# Altium project power-v2.2.PrjPCB
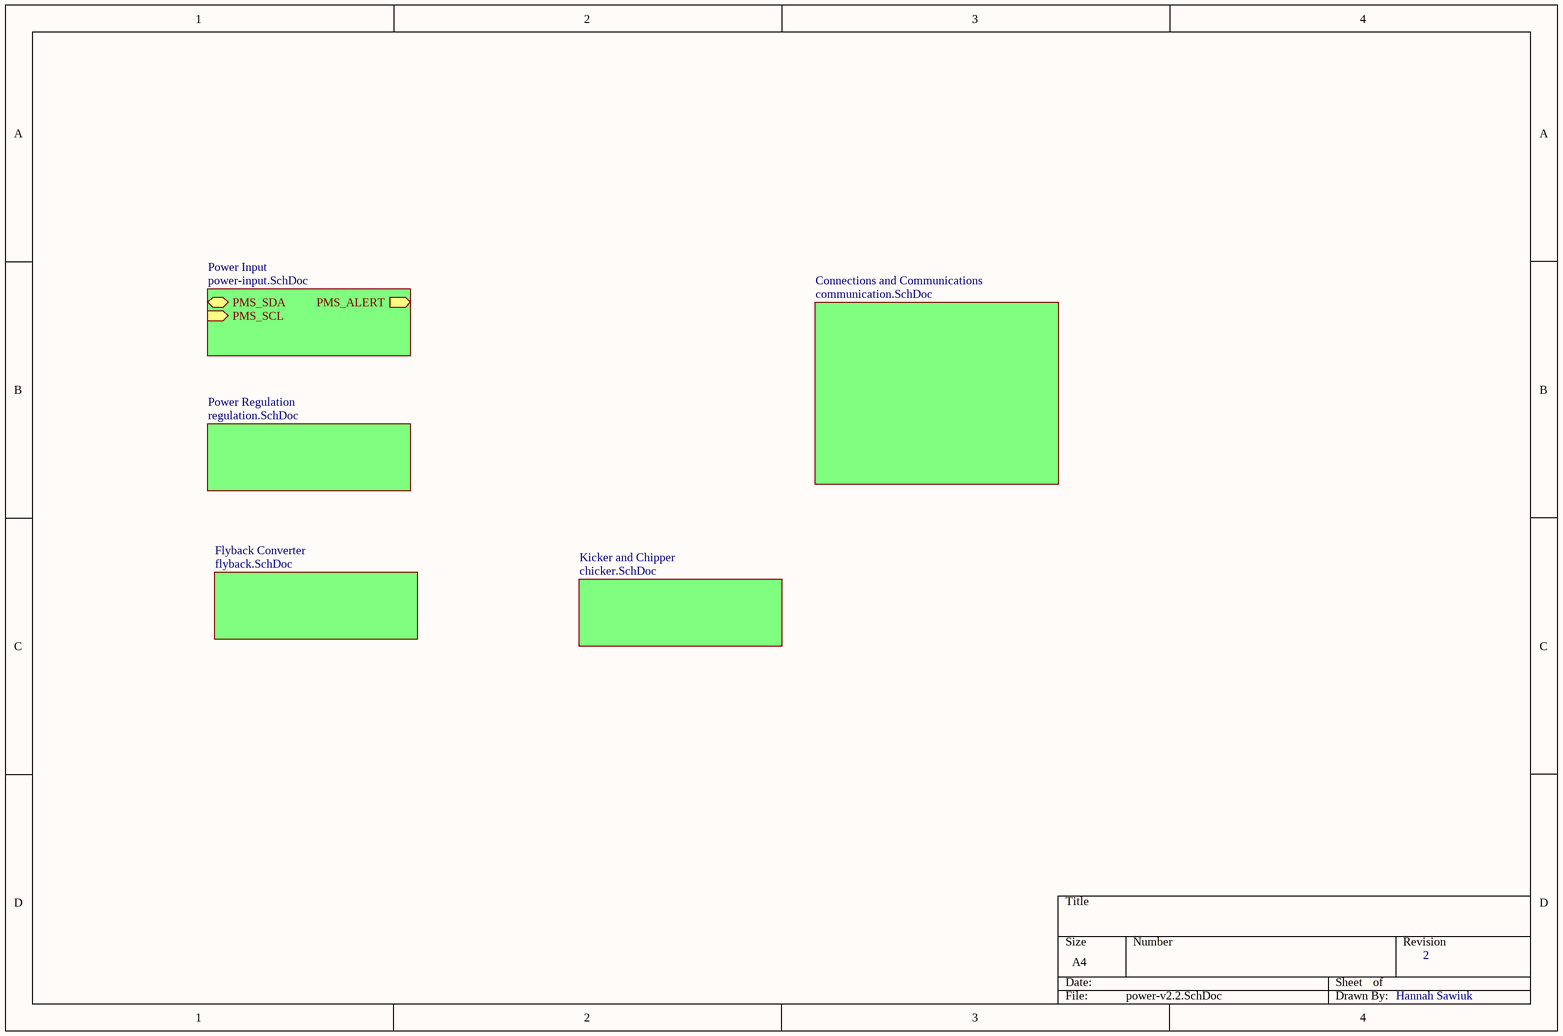
[diagram p0: power-v2.2.SchDoc]
6 sheets, 88 parts. Net scope: hierarchical (ports join the sheet entries above them; power ports are global).
Board file: power-v2.2.PcbDoc
Sheets:
  power-v2.2.SchDoc
    Flyback Converter = flyback.SchDoc
    Power Regulation = regulation.SchDoc
    Kicker and Chipper = chicker.SchDoc
    Power Input = power-input.SchDoc
    Connections and Communications = communication.SchDoc

## Sheet power-v2.2.SchDoc
size A4

### Sub-sheets
Connections and Communications = communication.SchDoc: no entries
Flyback Converter = flyback.SchDoc: no entries
Kicker and Chipper = chicker.SchDoc: no entries
Power Input = power-input.SchDoc: PMS_SDA (bidir), PMS_SCL (in), PMS_ALERT (out)
Power Regulation = regulation.SchDoc: no entries

### Notes on the sheet
- 2
- Hannah Sawiuk

## Sheet flyback.SchDoc
size A4
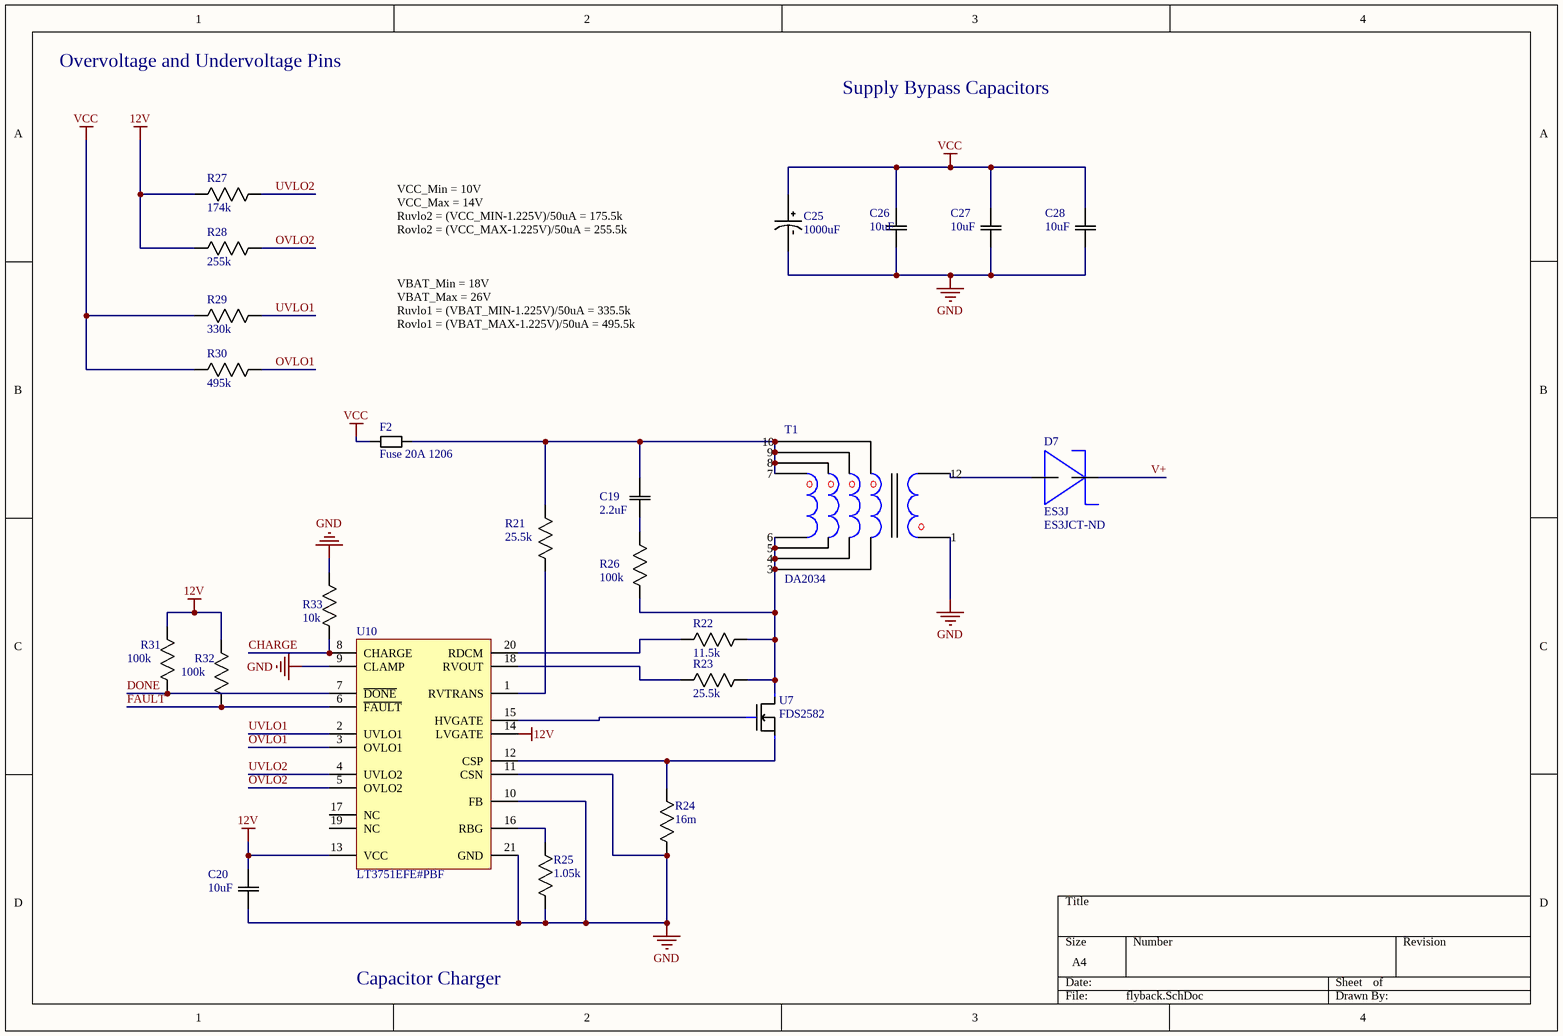
[diagram p1: flyback.SchDoc]

### Parts
C19  2.2uF  [0805]
C20  10uF  [0805]
C25  1000uF  [CAP POL 1000uF THRU]
C26  10uF  [0805]
C27  10uF  [0805]
C28  10uF  [0805]
D7  ES3J  Supplier Part Number 1: ES3JCT-ND  [D0214-AB]
F2  Fuse 20A 1206  [1206]
R21  25.5k  [0805]
R22  11.5k  [0805]
R23  25.5k  [0805]
R24  16m  [0805]
R25  1.05k  [0805]
R26  100k  [0805]
R27  174k  [0805]
R28  255k  [0805]
R29  330k  [0805]
R30  495k  [0805]
R31  100k  [0805]
R32  100k  [0805]
R33  10k  [0805]
T1  DA2034  [DA2034]
U7  FDS2582  [8-SOIC MOSFET]
U10  LT3751EFE#PBF  [LT-FE-20-EPV-CB_L]

### Nets
12V: C20.1(C1) R27.2(R2) R28.2(R2) R31.2(R2) R32.2(R2) U10.13(VCC) U10.14(LVGATE)
GND: C20.2(C2) C25.NEG C26.2(C2) C27.2(C2) C28.2(C2) R24.2(R2) R25.2(R2) R33.1(R1) T1.1 U10.9(CLAMP) U10.10(FB) U10.11(CSN) U10.21(GND)
VCC: C25.POS C26.1(C1) C27.1(C1) C28.1(C1) F2.1 R29.2(R2) R30.2(R2)
CHARGE: R33.2(R2) U10.8(CHARGE)
DONE: R31.1(R1) U10.7(~{DONE})
FAULT: R32.1(R1) U10.6(~{FAULT})
OVLO1: R30.1(R1) U10.3(OVLO1)
OVLO2: R28.1(R1) U10.5(OVLO2)
UVLO1: R29.1(R1) U10.2(UVLO1)
UVLO2: R27.1(R1) U10.4(UVLO2)
V+: D7.OUT
NetC19_1: C19.1(C1) R26.1(R1)
NetC19_2: C19.2(C2) F2.2 R21.1(R1) T1.7 T1.8 T1.9 T1.10
NetD7_IN: D7.IN T1.12
NetR21_2: R21.2(R2) U10.1(RVTRANS)
NetR22_1: R22.1(R1) R23.1(R1) R26.2(R2) T1.3 T1.4 T1.5 T1.6 U7.D
NetR22_2: R22.2(R2) U10.20(RDCM)
NetR23_2: R23.2(R2) U10.18(RVOUT)
NetR24_1: R24.1(R1) U7.S U10.12(CSP)
NetR25_1: R25.1(R1) U10.16(RBG)
NetU7_G: U7.G U10.15(HVGATE)

Not connected (* = marked no-connect by the designer): U10 17(NC) 19(NC)

### Notes on the sheet
- Overvoltage and Undervoltage Pins
- Supply Bypass Capacitors
- VCC_Min = 10V
  VCC_Max = 14V
  Ruvlo2 = (VCC_MIN-1.225V)/50uA = 175.5k
  Rovlo2 = (VCC_MAX-1.225V)/50uA = 255.5k
- VBAT_Min = 18V
  VBAT_Max = 26V
  Ruvlo1 = (VBAT_MIN-1.225V)/50uA = 335.5k
  Rovlo1 = (VBAT_MAX-1.225V)/50uA = 495.5k
- Capacitor Charger

### Library data of the parts
C19 = CAP 2.2uF 0805: CAP CER 1UF 50V X7R 0805; MP: C0805C225K4RACTU; MF: KEMET; Tolerance: 10%; Rating: 16V; Package: 0805; Price: 0,461 CAD; Value: 2.2uF; Digikey: 399-3523-1-ND; Digikey Link: https://www.digikey.ca/products/en?keywords=399-3523-1-ND
C20 C26-C28 = CAP 10uF 0805: CAP CER 10UF 10V X5R 0805; MP: C0805C106K8PACTU; MF: KEMET; Tolerance: 10%; Package: 0805; Price: 0.168 CAD; Value: 10uF; Digikey: 399-4925-1-ND; Digikey Link: https://www.digikey.ca/product-detail/en/kemet/C0805C106K8PACTU/399-4925-1-ND/1090920; Rating: 10V
C25 = CAP POL 1000uF THRU: NICHICON   UVR1E102MPD1TD   ALUMINUM ELECTROLYTIC CAPACITOR, 1000UF, 25V, 20%, RADIAL, FULL REEL; Dielectric Material: Aluminium; Life (Hours): 2000Hour; Capacitance: 1mF; Leakage Current: 750uA; Dissipation Factor: 0.16%; Ripple Current: 960mA; Lead Diameter: 0.6mm; Supplier 1: Digi-Key; Manufacturer: Nichicon; Manufacturer Part Number: UVR1E102MPD1TD; RoHS: Yes; Category: Aluminum Electrolytic Capacitors; Stock 1: 43448; Pricing 1: 1=0.58000, 10=0.40800, 100=0.26890 (USD); Mount: Through Hole,PCB; Case/Package: Radial; Number of Pins: 2; Min Operating Temperature: -40°C; Max Operating Temperature: 85°C; Packaging: Tape and Reel; Tolerance: 20%; Voltage Rating (DC): 25V; Voltage Rating: 25V; Termination: Radial; Voltage: 25V; Package Quantity: 500; Diameter: 10mm; Length: 20mm; Height: 20mm; Height - Seated (Max): 0.866inch; Lead Pitch: 5mm; Radiation Hardening: No; REACH SVHC: No SVHC; Lead Free: Lead Free; ComponentLink1URL: https://datasheet.ciiva.com/7851/e-vr-7851718.pdf?src-supplier=Element14; ComponentLink1Description: https://datasheet.ciiva.com/7851/e-vr-7851718.pdf?src-supplier=Element14; ComponentLink2URL: https://datasheet.ciiva.com/6300/e-vr-6300009.pdf?src-supplier=Digi-Key; ComponentLink2Description: https://datasheet.ciiva.com/6300/e-vr-6300009.pdf?src-supplier=Digi-Key; ComponentLink3URL: https://datasheet.ciiva.com/6300/e-vr-6300010.pdf?src-supplier=Digi-Key; ComponentLink3Description: https://datasheet.ciiva.com/6300/e-vr-6300010.pdf?src-supplier=Digi-Key; ComponentLink4URL: https://datasheet.ciiva.com/11684/e-vr-11684106.pdf?src-supplier=Avnet; ComponentLink4Description: https://datasheet.ciiva.com/11684/e-vr-11684106.pdf?src-supplier=Avnet; ComponentLink5URL: https://datasheet.ciiva.com/16502/e-vr-16502813.pdf?src-supplier=Future+Electronics; ComponentLink5Description: https://datasheet.ciiva.com/16502/e-vr-16502813.pdf?src-supplier=Future+Electronics; ComponentLink6URL: https://datasheet.ciiva.com/46381/1909356-46381757.pdf?src-supplier=Element14; ComponentLink6Description: https://datasheet.ciiva.com/46381/1909356-46381757.pdf?src-supplier=Element14; Supplier Part Number 1: 493-5913-1-ND
D7 = ES3J: Diode Switching 600V 3A 2-Pin DO-214AB T/R; Manufacturer: ON Semiconductor / Fairchild; Element Configuration: Single; Power Dissipation: 1.66W; Reverse Recovery Time: 35ns; Peak Non-Repetitive Surge Current: 100A; Polarity: Standard; Capacitance: 45pF; Forward Voltage: 1.7V; Peak Reverse Current: 10uA; Supplier 1: Digi-Key; Manufacturer Part Number: ES3J; RoHS: Yes; Category: Zener Diodes; Stock 1: 20740; Pricing 1: 1=0.47000, 10=0.37800, 25=0.34600, 100=0.21740, 250=0.21492, 500=0.20126, 1000=0.13685 (USD); Mount: Surface Mount; Case/Package: SMC; Number of Pins: 2; Contact Plating: Tin,Matte; Min Operating Temperature: -50°C; Max Operating Temperature: 150°C; Reverse Voltage: 600V; Max Reverse Voltage (DC): 600V; Average Rectified Current: 3A; Max Repetitive Reverse Voltage (Vrrm): 600V; Max Forward Surge Current (Ifsm): 100A; Current: 3A; Voltage: 600V; Voltage Rating (DC): 600V; Current Rating: 3A; Output Current: 3A; Max Surge Current: 100A; Packaging: Tape and Reel; Package Quantity: 3000; Recovery Time: 35ns; Forward Current: 3A; Length: 7.11mm; Height: 2.616mm; Width: 6.223mm; Radiation Hardening: No; REACH SVHC: No SVHC; Lead Free: Lead Free; ComponentLink1URL: https://datasheet.ciiva.com/4452/es3j-187547-4452440.pdf?src-supplier=Mouser; ComponentLink1Description: https://datasheet.ciiva.com/4452/es3j-187547-4452440.pdf?src-supplier=Mouser; ComponentLink2URL: https://datasheet.ciiva.com/30479/0900766b810e1d0b-30479500.pdf?src-supplier=RSComponents; ComponentLink2Description: https://datasheet.ciiva.com/30479/0900766b810e1d0b-30479500.pdf?src-supplier=RSComponents; ComponentLink3URL: https://datasheet.ciiva.com/22651/1856389-22651960.pdf?src-supplier=Element14; ComponentLink3Description: https://datasheet.ciiva.com/22651/1856389-22651960.pdf?src-supplier=Element14; ComponentLink4URL: https://datasheet.ciiva.com/26230/es3j-26230952.pdf?src-supplier=Avnet+Europe; ComponentLink4Description: https://datasheet.ciiva.com/26230/es3j-26230952.pdf?src-supplier=Avnet+Europe; ComponentLink5URL: https://datasheet.ciiva.com/911/es3a-911003.pdf?src-supplier=Digi-Key; ComponentLink5Description: https://datasheet.ciiva.com/911/es3a-911003.pdf?src-supplier=Digi-Key; ComponentLink6URL: https://datasheet.ciiva.com/911/es3a-911004.pdf?src-supplier=Digi-Key; ComponentLink6Description: https://datasheet.ciiva.com/911/es3a-911004.pdf?src-supplier=Digi-Key; ComponentLink7URL: https://datasheet.ciiva.com/23683/1856389-23683564.pdf?src-supplier=Newark; ComponentLink7Description: https://datasheet.ciiva.com/23683/1856389-23683564.pdf?src-supplier=Newark; ComponentLink8URL: https://datasheet.ciiva.com/17194/es3j-17194703.pdf?src-supplier=Future+Electronics; ComponentLink8Description: https://datasheet.ciiva.com/17194/es3j-17194703.pdf?src-supplier=Future+Electronics; ComponentLink9URL: https://datasheet.ciiva.com/7965/1856389-7965165.pdf?src-supplier=Element14; ComponentLink9Description: https://datasheet.ciiva.com/7965/1856389-7965165.pdf?src-supplier=Element14; ComponentLink10URL: https://datasheet.ciiva.com/8300/es3j-8300861.pdf?src-supplier=Avnet; ComponentLink10Description: https://datasheet.ciiva.com/8300/es3j-8300861.pdf?src-supplier=Avnet
F2 = FUSE 20A 63V SLOW: FUSE 20A 32V AC 63V DC 1206; Response Time: Slow Blow; Current Rating (Amps): 20A; Voltage Rating - AC: 32V; Voltage Rating - DC: 63V; Operating Temperature: -55°C ~ 90°C
R21 R23 = RES 25.5k 0805: 0805 Resistor, 6A, 0.125W, 25ppm, 0.1%, 25K5; Manufacturer: Panasonic; Manufacturer Part Number: ERA-6AEB2552V; Temperature Coefficient: 25ppm/°C; Max Power Dissipation: 125mW; Resistance: 25.5kR; Voltage Rating: 100V; Supplier 1: Digi-Key; RoHS: Yes; Category: Chip SMD Resistors; Stock 1: 5872; Pricing 1: 1=0.36000, 10=0.30200, 100=0.11820, 1000=0.04948, 2500=0.04536 (USD); Mount: Surface Mount; Case/Package: 0805; Number of Pins: 2; Case Code (Imperial): 0805; Case Code (Metric): 2012; Contact Plating: Tin; Min Operating Temperature: -55°C; Max Operating Temperature: 155°C; Number of Terminations: 2; Features: Automotive AEC-Q200; Tolerance: 0.1%; Composition: Metal Film,Thin Film; Packaging: Tape and Reel; Military Standard: Not; Termination: Solder; Power Rating: 125mW; Package Quantity: 1; Voltage Rating (DC): 100V; Length: 2mm; Height: 0.5mm; Width: 1.25mm; Depth: 1.25mm; Radiation Hardening: No; Lead Free: Lead Free; ComponentLink1URL: https://datasheet.ciiva.com/11810/0900766b80eb1d8c-11810651.pdf?src-supplier=RSComponents; ComponentLink1Description: https://datasheet.ciiva.com/11810/0900766b80eb1d8c-11810651.pdf?src-supplier=RSComponents; ComponentLink2URL: https://datasheet.ciiva.com/26335/459526-da-01-en-widerstand-0805-era-26335831.pdf?src-supplier=Conrad; ComponentLink2Description: https://datasheet.ciiva.com/26335/459526-da-01-en-widerstand-0805-era-26335831.pdf?src-supplier=Conrad; ComponentLink3URL: https://datasheet.ciiva.com/7870/485442-7870651.pdf?src-supplier=Element14; ComponentLink3Description: https://datasheet.ciiva.com/7870/485442-7870651.pdf?src-supplier=Element14; ComponentLink4URL: https://datasheet.ciiva.com/5987/485442-5987308.pdf?src-supplier=Farnell; ComponentLink4Description: https://datasheet.ciiva.com/5987/485442-5987308.pdf?src-supplier=Farnell; ComponentLink5URL: https://datasheet.ciiva.com/7870/485442-7870652.pdf?src-supplier=Element14; ComponentLink5Description: https://datasheet.ciiva.com/7870/485442-7870652.pdf?src-supplier=Element14; ComponentLink6URL: https://datasheet.ciiva.com/30151/54aoa0000ce26-30151583.pdf?src-supplier=Onlinecomponents.com; ComponentLink6Description: https://datasheet.ciiva.com/30151/54aoa0000ce26-30151583.pdf?src-supplier=Onlinecomponents.com; ComponentLink7URL: https://datasheet.ciiva.com/9191/aoa0000ce26-9191422.pdf?src-supplier=Avnet; ComponentLink7Description: https://datasheet.ciiva.com/9191/aoa0000ce26-9191422.pdf?src-supplier=Avnet; Supplier Part Number 1: P25.5KDACT-ND
R22 = RES 11.5k 0805: Res Thin Film 0805 11.5K Ohm 0.1% 1/8W 25ppm/C Molded SMD SMD Punched Carrier T/R; Manufacturer: Panasonic; Manufacturer Part Number: ERA-6AEB1152V; Power Rating: 125mW; Resistance: 11.5kR; Voltage Rating: 100V; Temperature Coefficient: 25ppm/°C; Supplier 1: Digi-Key; RoHS: Yes; Category: Chip SMD Resistors; Stock 1: 10661; Pricing 1: 1=0.34000, 10=0.28800, 100=0.11260, 1000=0.04712, 2500=0.04320 (USD); Mount: Surface Mount; Case/Package: 0805; Number of Pins: 2; Case Code (Metric): 2012; Case Code (Imperial): 0805; Contact Plating: Tin; Min Operating Temperature: -55°C; Max Operating Temperature: 155°C; Tolerance: 0.1%; Packaging: Tape and Reel; Max Power Dissipation: 125mW; Composition: Thin Film,Metal Film; Number of Terminations: 2; Voltage Rating (DC): 100V; Termination: Solder; Military Standard: Not; Package Quantity: 1; Features: Automotive AEC-Q200; Length: 2mm; Height: 0.5mm; Width: 1.25mm; Depth: 1.25mm; Radiation Hardening: No; Lead Free: Lead Free; ComponentLink1URL: https://datasheet.ciiva.com/11810/0900766b80eb1d8c-11810868.pdf?src-supplier=RSComponents; ComponentLink1Description: https://datasheet.ciiva.com/11810/0900766b80eb1d8c-11810868.pdf?src-supplier=RSComponents; ComponentLink2URL: https://datasheet.ciiva.com/41450/001181306-da-01-en-widerstand-era-0805-11k5-0-1-5000st-41450464.pdf?src-supplier=Conrad; ComponentLink2Description: https://datasheet.ciiva.com/41450/001181306-da-01-en-widerstand-era-0805-11k5-0-1-5000st-41450464.pdf?src-supplier=Conrad; ComponentLink3URL: https://datasheet.ciiva.com/5987/485442-5987301.pdf?src-supplier=Farnell; ComponentLink3Description: https://datasheet.ciiva.com/5987/485442-5987301.pdf?src-supplier=Farnell; ComponentLink4URL: https://datasheet.ciiva.com/7829/485442-7829142.pdf?src-supplier=Element14; ComponentLink4Description: https://datasheet.ciiva.com/7829/485442-7829142.pdf?src-supplier=Element14; ComponentLink5URL: https://datasheet.ciiva.com/17211/aoa0000ce26-17211855.pdf?src-supplier=Avnet+Europe; ComponentLink5Description: https://datasheet.ciiva.com/17211/aoa0000ce26-17211855.pdf?src-supplier=Avnet+Europe; ComponentLink6URL: https://datasheet.ciiva.com/7829/485442-7829143.pdf?src-supplier=Element14; ComponentLink6Description: https://datasheet.ciiva.com/7829/485442-7829143.pdf?src-supplier=Element14; ComponentLink7URL: https://datasheet.ciiva.com/9193/aoa0000ce26-9193735.pdf?src-supplier=Avnet; ComponentLink7Description: https://datasheet.ciiva.com/9193/aoa0000ce26-9193735.pdf?src-supplier=Avnet; ComponentLink8URL: https://datasheet.ciiva.com/24024/aoa0000ce26-197354-24024328.pdf?src-supplier=Mouser; ComponentLink8Description: https://datasheet.ciiva.com/24024/aoa0000ce26-197354-24024328.pdf?src-supplier=Mouser; Supplier Part Number 1: P11.5KDACT-ND
R24 = RES 16mOhm 0805: Res Thick Film 0805 0.016 Ohm 1% 0.5W(1/2W) ±200ppm/C Molded SMD Automotive Punched T/R; Manufacturer: Panasonic; Manufacturer Part Number: ERJ-6BWFR016V; Resistance: 16mR; Power Rating: 500mW; Temperature Coefficient: 200ppm/°C; Supplier 1: Digi-Key; RoHS: Yes; Category: Chip SMD Resistors; Stock 1: 4585; Pricing 1: 1=0.65000, 10=0.53800, 100=0.36140, 1000=0.21148, 2500=0.20917 (USD); Mount: Surface Mount; Case/Package: 0805; Number of Pins: 2; Contact Plating: Tin; Case Code (Metric): 2012; Case Code (Imperial): 0805; Min Operating Temperature: -55°C; Max Operating Temperature: 155°C; Tolerance: 1%; Packaging: Tape and Reel; Package Quantity: 1; Features: Automotive AEC-Q200; Max Power Dissipation: 500mW; Composition: Thick Film; Number of Terminations: 2; Termination: SMD/SMT; Military Standard: Not; Length: 2mm; Height: 0.028inch; Width: 0.049inch; Depth: 1.25mm; Radiation Hardening: No; Lead Free: Lead Free; ComponentLink1URL: https://datasheet.ciiva.com/11808/0900766b8126441d-11808690.pdf?src-supplier=RSComponents; ComponentLink1Description: https://datasheet.ciiva.com/11808/0900766b8126441d-11808690.pdf?src-supplier=RSComponents; ComponentLink2URL: https://datasheet.ciiva.com/2452/aoa0000ce3-2452594.pdf?src-supplier=Digi-Key; ComponentLink2Description: https://datasheet.ciiva.com/2452/aoa0000ce3-2452594.pdf?src-supplier=Digi-Key; ComponentLink3URL: https://datasheet.ciiva.com/2452/aoa0000ce3-2452592.pdf?src-supplier=Digi-Key; ComponentLink3Description: https://datasheet.ciiva.com/2452/aoa0000ce3-2452592.pdf?src-supplier=Digi-Key; ComponentLink4URL: https://datasheet.ciiva.com/2452/aoa0000ce3-2452593.pdf?src-supplier=Digi-Key; ComponentLink4Description: https://datasheet.ciiva.com/2452/aoa0000ce3-2452593.pdf?src-supplier=Digi-Key; ComponentLink5URL: https://datasheet.ciiva.com/9192/aoa0000ce3-9192761.pdf?src-supplier=Avnet; ComponentLink5Description: https://datasheet.ciiva.com/9192/aoa0000ce3-9192761.pdf?src-supplier=Avnet; ComponentLink6URL: https://datasheet.ciiva.com/17211/aoa0000ce3-17211370.pdf?src-supplier=Avnet+Europe; ComponentLink6Description: https://datasheet.ciiva.com/17211/aoa0000ce3-17211370.pdf?src-supplier=Avnet+Europe; Supplier Part Number 1: P.016AQCT-ND
R25 = RES 1.05k 0805: Res Thin Film 0805 10.5K Ohm 0.1% 0.125W(1/8W) ±25ppm/C Molded SMD Automotive Punched T/R; Manufacturer: Panasonic; Manufacturer Part Number: ERA-6AEB1052V; Resistance: 10.5kR; Power Rating: 125mW; Voltage Rating: 100V; Temperature Coefficient: 25ppm/°C; Supplier 1: Digi-Key; RoHS: Yes; Category: Chip SMD Resistors; Stock 1: 21208; Pricing 1: 1=0.34000, 10=0.28800, 100=0.11260, 1000=0.04712, 2500=0.04320 (USD); Mount: Surface Mount; Case/Package: 0805; Number of Pins: 2; Case Code (Metric): 2012; Case Code (Imperial): 0805; Contact Plating: Tin; Min Operating Temperature: -55°C; Max Operating Temperature: 155°C; Tolerance: 0.1%; Packaging: Tape and Reel; Composition: Thin Film,Metal Film; Package Quantity: 1; Max Power Dissipation: 125mW; Number of Terminations: 2; Termination: Solder; Voltage Rating (DC): 100V; Features: Automotive AEC-Q200; Military Standard: Not; Length: 2mm; Height: 0.5mm; Width: 1.25mm; Depth: 1.25mm; Radiation Hardening: No; Lead Free: Lead Free; REACH SVHC: No SVHC; ComponentLink1URL: https://datasheet.ciiva.com/11810/0900766b80eb1d8c-11810443.pdf?src-supplier=RSComponents; ComponentLink1Description: https://datasheet.ciiva.com/11810/0900766b80eb1d8c-11810443.pdf?src-supplier=RSComponents; ComponentLink2URL: https://datasheet.ciiva.com/41450/001181303-da-01-en-widerstand-era-0805-10k5-0-1-5000st-41450463.pdf?src-supplier=Conrad; ComponentLink2Description: https://datasheet.ciiva.com/41450/001181303-da-01-en-widerstand-era-0805-10k5-0-1-5000st-41450463.pdf?src-supplier=Conrad; ComponentLink3URL: https://datasheet.ciiva.com/5987/485442-5987261.pdf?src-supplier=Farnell; ComponentLink3Description: https://datasheet.ciiva.com/5987/485442-5987261.pdf?src-supplier=Farnell; ComponentLink4URL: https://datasheet.ciiva.com/17211/aoa0000ce26-17211965.pdf?src-supplier=Avnet+Europe; ComponentLink4Description: https://datasheet.ciiva.com/17211/aoa0000ce26-17211965.pdf?src-supplier=Avnet+Europe; ComponentLink5URL: https://datasheet.ciiva.com/9194/aoa0000ce26-9194028.pdf?src-supplier=Avnet; ComponentLink5Description: https://datasheet.ciiva.com/9194/aoa0000ce26-9194028.pdf?src-supplier=Avnet; ComponentLink6URL: https://datasheet.ciiva.com/5987/485442-5987263.pdf?src-supplier=Farnell; ComponentLink6Description: https://datasheet.ciiva.com/5987/485442-5987263.pdf?src-supplier=Farnell; Supplier Part Number 1: P10.5KDACT-ND
R26 R31 R32 = RES 100k 0805: RES SMD 100K OHM 1% 1/8W 0805; MP: RC0805FR-07100KL; MF: Yageo; Rating: 0.125W; Digikey: 311-100KCRCT-ND; Price: 0.058 CAD; Package: 0805; Value: 100k; Digikey Link: https://www.digikey.ca/products/en?keywords=311-100KCRCT-ND; Tolerance: 1%
R27 = RES 174k 0805: RES SMD 174K OHM 1% 1/8W 0805; Manufacturer: Yageo; Manufacturer Part Number: RC0805FR-07174KL; Max Power Dissipation: 125mW; Resistance: 174kR; Temperature Coefficient: 100ppm/°C; Voltage Rating: 150V; Supplier 1: Digi-Key; RoHS: Yes; Category: Chip SMD Resistors; Stock 1: 27863; Pricing 1: 1=0.10000, 10=0.04000, 100=0.01630, 1000=0.00731, 2500=0.00635 (USD); Case/Package: 0805; Case Code (Metric): 2012; Case Code (Imperial): 0805; Contact Plating: Tin,Matte; Min Operating Temperature: -55°C; Max Operating Temperature: 155°C; Package Quantity: 1; Power Rating: 125mW; Tolerance: 1%; Packaging: Tape and Reel; Features: Moisture Resistant; Composition: Thick Film; Number of Terminations: 2; Termination: SMD/SMT; Military Standard: Not; Voltage Rating (DC): 150V; Length: 2mm; Height: 0.024inch; Width: 0.049inch; Depth: 1.25mm; Radiation Hardening: No; Lead Free: Lead Free; ComponentLink1URL: https://datasheet.ciiva.com/2509/pyu-r-int-thick-7-2509472.pdf?src-supplier=Digi-Key; ComponentLink1Description: https://datasheet.ciiva.com/2509/pyu-r-int-thick-7-2509472.pdf?src-supplier=Digi-Key; ComponentLink2URL: https://datasheet.ciiva.com/2509/pyu-r-int-thick-7-2509471.pdf?src-supplier=Digi-Key; ComponentLink2Description: https://datasheet.ciiva.com/2509/pyu-r-int-thick-7-2509471.pdf?src-supplier=Digi-Key; ComponentLink3URL: https://datasheet.ciiva.com/2509/pyu-r-int-thick-7-2509473.pdf?src-supplier=Digi-Key; ComponentLink3Description: https://datasheet.ciiva.com/2509/pyu-r-int-thick-7-2509473.pdf?src-supplier=Digi-Key; Supplier Part Number 1: 311-174KCRCT-ND
R28 = RES 255k 0805: 0805 Resistor, 6A, 0.125W, 25ppm, 0.1%, 255K; Manufacturer: Panasonic; Manufacturer Part Number: ERA-6AEB2553V; Max Power Dissipation: 125mW; Resistance: 255kR; Temperature Coefficient: 25ppm/°C; Voltage Rating (DC): 100V; Voltage Rating: 200V; Supplier 1: Digi-Key; RoHS: Yes; Category: Chip SMD Resistors; Stock 1: 7869; Pricing 1: 1=0.36000, 10=0.30200, 100=0.11820, 1000=0.04948, 2500=0.04536 (USD); Mount: Surface Mount; Case/Package: 0805; Number of Pins: 2; Weight: 0.000194oz; Case Code (Imperial): 0805; Case Code (Metric): 2012; Contact Plating: Tin; Min Operating Temperature: -55°C; Max Operating Temperature: 155°C; Features: Automotive AEC-Q200; Tolerance: 0.1%; Number of Terminations: 2; Packaging: Tape and Reel; Composition: Metal Film,Thin Film; Power Rating: 125mW; Termination: SMD/SMT; Military Standard: Not; Package Quantity: 1; Length: 2mm; Height: 0.5mm; Width: 1.25mm; Depth: 1.25mm; Radiation Hardening: No; Lead Free: Lead Free; REACH SVHC: No SVHC; ComponentLink1URL: https://datasheet.ciiva.com/11810/0900766b80eb1d8c-11810615.pdf?src-supplier=RSComponents; ComponentLink1Description: https://datasheet.ciiva.com/11810/0900766b80eb1d8c-11810615.pdf?src-supplier=RSComponents; ComponentLink2URL: https://datasheet.ciiva.com/41450/001181380-da-01-en-widerstand-era-0805-255k-0-1-5000st-41450539.pdf?src-supplier=Conrad; ComponentLink2Description: https://datasheet.ciiva.com/41450/001181380-da-01-en-widerstand-era-0805-255k-0-1-5000st-41450539.pdf?src-supplier=Conrad; ComponentLink3URL: https://datasheet.ciiva.com/5981/485442-5981317.pdf?src-supplier=Farnell; ComponentLink3Description: https://datasheet.ciiva.com/5981/485442-5981317.pdf?src-supplier=Farnell; ComponentLink4URL: https://datasheet.ciiva.com/5981/485442-5981318.pdf?src-supplier=Farnell; ComponentLink4Description: https://datasheet.ciiva.com/5981/485442-5981318.pdf?src-supplier=Farnell; ComponentLink5URL: https://datasheet.ciiva.com/5981/485442-5981319.pdf?src-supplier=Farnell; ComponentLink5Description: https://datasheet.ciiva.com/5981/485442-5981319.pdf?src-supplier=Farnell; ComponentLink6URL: https://datasheet.ciiva.com/5981/485442-5981320.pdf?src-supplier=Farnell; ComponentLink6Description: https://datasheet.ciiva.com/5981/485442-5981320.pdf?src-supplier=Farnell; ComponentLink7URL: https://datasheet.ciiva.com/17206/aoa0000ce26-17206655.pdf?src-supplier=Avnet+Europe; ComponentLink7Description: https://datasheet.ciiva.com/17206/aoa0000ce26-17206655.pdf?src-supplier=Avnet+Europe; Supplier Part Number 1: P255KDACT-ND
R29 = RES 330k 0805: RES SMD 274K OHM 1% 1/8W 0805
R30 = RES 495k 0805: RES SMD 499K OHM 1% 1/8W 0805; Manufacturer: Yageo; Manufacturer Part Number: RC0805FR-07499KL; Temperature Coefficient: 100ppm/°C; Voltage Rating (DC): 150V; Resistance: 499kR; Power Rating: 125mW; Supplier 1: Digi-Key; RoHS: Yes; Category: Chip SMD Resistors; Stock 1: 2275; Pricing 1: 1=0.10000, 10=0.04000, 100=0.01630, 1000=0.00731, 2500=0.00635 (USD); Case/Package: 0805; Case Code (Metric): 2012; Case Code (Imperial): 0805; Contact Plating: Tin,Lead,Matte; Min Operating Temperature: -55°C; Max Operating Temperature: 155°C; Termination: SMD/SMT; Composition: Thick Film; Military Standard: Not; Tolerance: 1%; Voltage Rating: 150V; Packaging: Tape and Reel; Length: 2mm; Depth: 1.25mm; Radiation Hardening: No; Lead Free: Lead Free; ComponentLink1URL: https://datasheet.ciiva.com/15189/getdatasheetpartid-326570-15189975.pdf?src-supplier=Verical; ComponentLink1Description: https://datasheet.ciiva.com/15189/getdatasheetpartid-326570-15189975.pdf?src-supplier=Verical; Supplier Part Number 1: 311-499KCRCT-ND
R33 = RES 10k 1/8W: RES SMD 10K OHM 1% 1/8W 0805; Power (Watts): 0.125W; Package: 0805; Value: 10k; Tolerance: 1%
T1 = DA2034: Audio Transformers / Signal Transformers DA2032 Cap Chrgr For Linear LT3750/51
U7 = FDS2582: N-Channel 150V 4.1A (Ta) 2.5W (Ta) Surface Mount 8-SOIC; MF: ON Semiconductor; MP: FDS2582; Digikey: FDS2582CT-ND; Price: 0.98 CAD; Rating: 150V; Digikey Link: https://www.digikey.com/product-detail/en/on-semiconductor/FDS2582/FDS2582CT-ND/3025307; Package: 8-SOIC
U10 = LT3751EFE#PBF: Controller to 20-Pin TSSOP EP; Manufacturer: Analog Devices / Linear Technology; Output Voltage: 500V; Output Current: 150mA; Max Input Voltage: 24V; Min Supply Voltage: 4.75V; Number of Outputs: 1; Operating Supply Current: 5.5mA; Supplier 1: Digi-Key; Manufacturer Part Number: LT3751EFE#PBF; RoHS: Yes; Category: Voltage Regulators - Switching; Stock 1: 1231; Pricing 1: 1=9.26000, 25=6.14640, 100=5.08200, 250=4.82792, 500=4.71900 (USD); Case/Package: TSSOP; Number of Pins: 20; Min Operating Temperature: -40°C; Max Operating Temperature: 125°C; Package Quantity: 74; Packaging: Rail/Tube; Termination: SMD/SMT; Max Supply Voltage: 24V; Radiation Hardening: No; REACH SVHC: No SVHC; ComponentLink1URL: https://datasheet.ciiva.com/15104/getdatasheetpartid-472813-15104438.pdf?src-supplier=Verical; ComponentLink1Description: https://datasheet.ciiva.com/15104/getdatasheetpartid-472813-15104438.pdf?src-supplier=Verical; ComponentLink2URL: https://datasheet.ciiva.com/31429/1692507-31429494.pdf?src-supplier=Farnell; ComponentLink2Description: https://datasheet.ciiva.com/31429/1692507-31429494.pdf?src-supplier=Farnell; ComponentLink3URL: https://datasheet.ciiva.com/1964/27024-1964843.pdf?src-supplier=Digi-Key; ComponentLink3Description: https://datasheet.ciiva.com/1964/27024-1964843.pdf?src-supplier=Digi-Key

## Sheet regulation.SchDoc
size A4
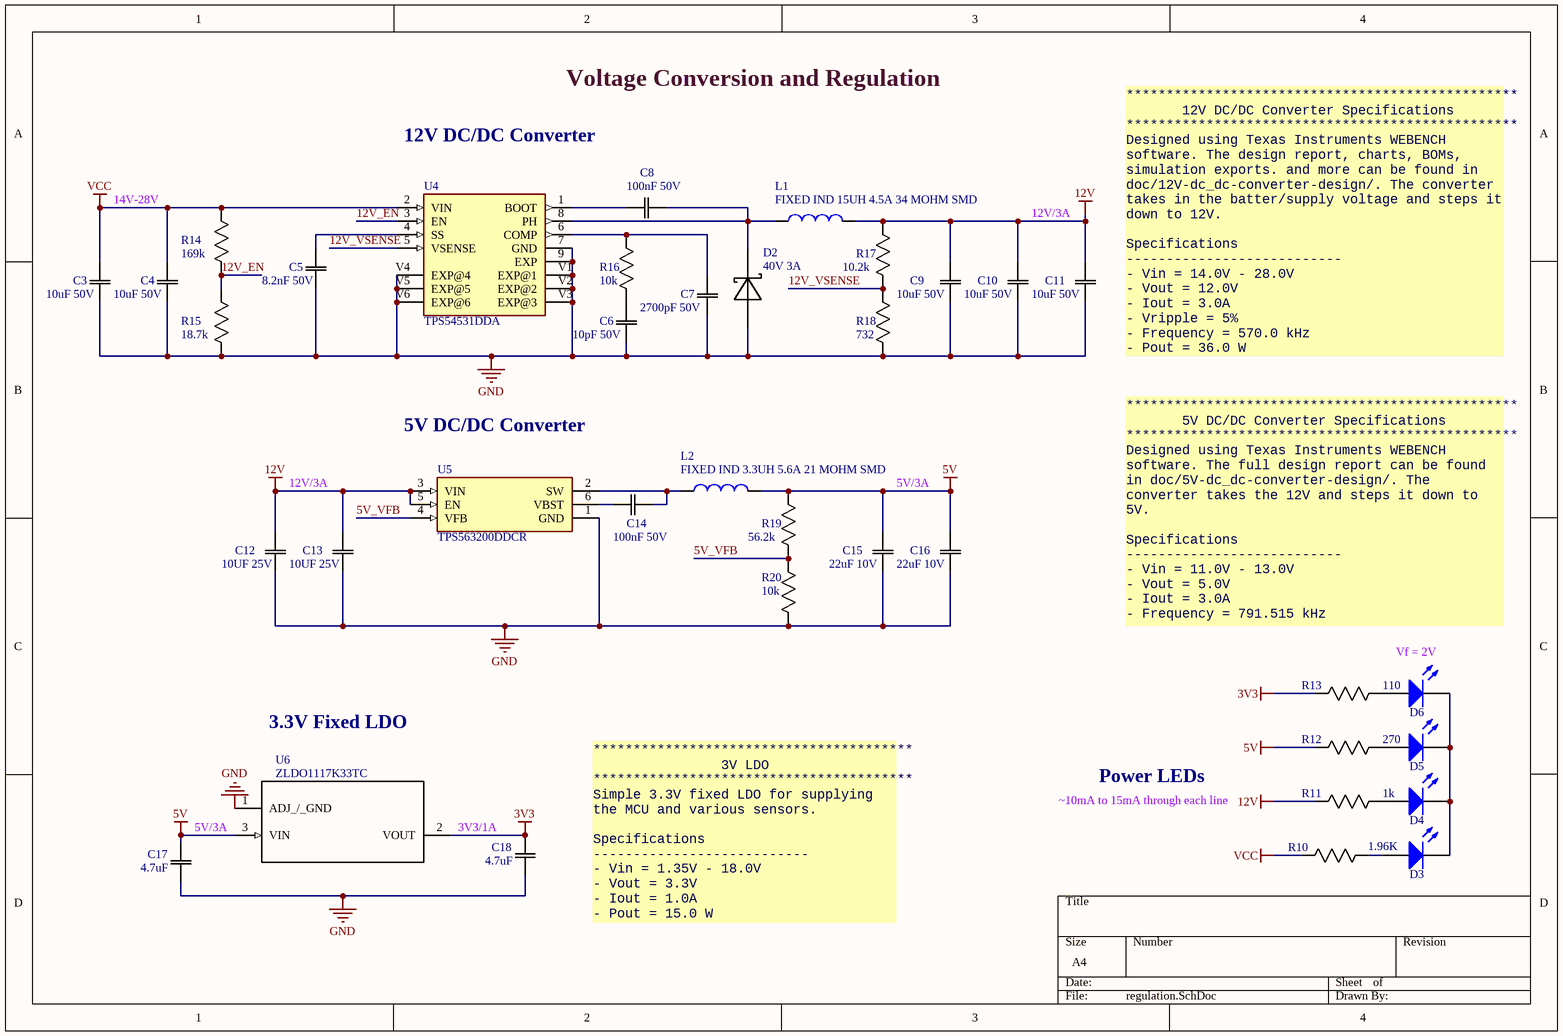
[diagram p2: regulation.SchDoc]

### Parts
C3  10uF 50V  [1210]
C4  10uF 50V  [1210]
C5  8.2nF 50V  [0805]
C6  10pF 50V  [0603]
C7  2700pF 50V  [0805]
C8  100nF 50V  [0805]
C9  10uF 50V  [1210]
C10  10uF 50V  [1210]
C11  10uF 50V  [1210]
C12  10UF 25V  [1206]
C13  10UF 25V  [1206]
C14  100nF 50V  [0805]
C15  22uF 10V  [0805]
C16  22uF 10V  [0805]
C17  4.7uF  [0805]
C18  4.7uF  [0805]
D2  40V 3A  [DO-214AC]
D3  LED2  [3.2X1.6X1.1]  (value not drawn)
D4  LED2  [3.2X1.6X1.1]  (value not drawn)
D5  LED2  [3.2X1.6X1.1]  (value not drawn)
D6  LED2  [3.2X1.6X1.1]  (value not drawn)
L1  FIXED IND 15UH 4.5A 34 MOHM SMD
L2  FIXED IND 3.3UH 5.6A 21 MOHM SMD
R10  1.96K  [0805]
R11  1k  [0805]
R12  270  [0805]
R13  110  [0805]
R14  169k  [0805]
R15  18.7k  [1206]
R16  10k  [0805]
R17  10.2k  [0805]
R18  732  [0805]
R19  56.2k  [0603]
R20  10k  [0805]
U4  TPS54531DDA  [8-PowerSOIC]
U5  TPS563200DDCR  [TSOT-23-6]
U6  ZLDO1117K33TC  [TO-252-3]

### Nets
3V3: C18.2(C2) R13.1(R1) U6.2(VOUT)
5V: C15.2(C2) C16.2(C2) C17.2(C2) L2.2 R12.1(R1) R19.1(R1) U6.3(VIN)
12V: C9.2(C2) C10.2(C2) C11.2(C2) C12.2(C2) C13.2(C2) L1.2 R11.1(R1) R17.2(R2) U5.3(VIN) U5.5(EN)
GND: C3.1(C1) C4.1(C1) C5.1(C1) C6.1(C1) C7.1(C1) C9.1(C1) C10.1(C1) C11.1(C1) C12.1(C1) C13.1(C1) C15.1(C1) C16.1(C1) C17.1(C1) C18.1(C1) D2.A R15.2(R2) R18.1(R1) R20.1(R1) U4.7(GND) U4.9(EXP) U4.V1(EXP@1) U4.V2(EXP@2) U4.V3(EXP@3) U4.V4(EXP@4) U4.V5(EXP@5) U4.V6(EXP@6) U5.1(GND) U6.1(ADJ_/_GND)
VCC: C3.2(C2) C4.2(C2) R10.1(R1) R14.1(R1) U4.2(VIN)
5V_VFB: R19.2(R2) R20.2(R2) U5.4(VFB)
12V_EN: R14.2(R2) R15.1(R1) U4.3(EN)
12V_VSENSE: R17.1(R1) R18.2(R2) U4.5(VSENSE)
NetC5_2: C5.2(C2) U4.4(SS)
NetC6_2: C6.2(C2) R16.2(R2)
NetC7_2: C7.2(C2) R16.1(R1) U4.6(COMP)
NetC8_1: C8.1(C1) U4.1(BOOT)
NetC8_2: C8.2(C2) D2.C(K) L1.1 U4.8(PH)
NetC14_1: C14.1(C1) U5.6(VBST)
NetC14_2: C14.2(C2) L2.1 U5.2(SW)
NetD3_1: D3.1(A) R10.2(R2)
NetD3_2: D3.2(K) D4.2(K) D5.2(K) D6.2(K)
NetD4_1: D4.1(A) R11.2(R2)
NetD5_1: D5.1(A) R12.2(R2)
NetD6_1: D6.1(A) R13.2(R2)

### Notes on the sheet
- Voltage Conversion and Regulation
- 12V DC/DC Converter
- 14V-28V
- 12V/3A
- (near C11) *************************************************
  12V DC/DC Converter Specifications
  *************************************************
  Designed using Texas Instruments WEBENCH software. The design report, charts, BOMs, simulation exports. and more can be found in doc/12V-dc_dc-converter-design/. The converter takes in the batter/supply voltage and steps it down to 12V.
  Specifications
  ---------------------------
  - Vin = 14.0V - 28.0V
  - Vout = 12.0V
  - Iout = 3.0A
  - Vripple = 5%
  - Frequency = 570.0 kHz
  - Pout = 36.0 W
- 5V DC/DC Converter
- 5V/3A
- *************************************************
  5V DC/DC Converter Specifications
  *************************************************
  Designed using Texas Instruments WEBENCH software. The full design report can be found in doc/5V-dc_dc-converter-design/. The converter takes the 12V and steps it down to 5V.
  Specifications
  ---------------------------
  - Vin = 11.0V - 13.0V
  - Vout = 5.0V
  - Iout = 3.0A
  - Frequency = 791.515 kHz
  - Pout = 15.0 W
- Vf = 2V
- 3.3V Fixed LDO
- Power LEDs
- 3V3/1A
- ~10mA to 15mA through each line
- ****************************************
  3V LDO
  ****************************************
  Simple 3.3V fixed LDO for supplying the MCU and various sensors.
  Specifications
  ---------------------------
  - Vin = 1.35V - 18.0V
  - Vout = 3.3V
  - Iout = 1.0A
  - Pout = 15.0 W

### Library data of the parts
C3 C4 C9-C11 = CAP 10uF 50V: CAP CER 10UF 50V X7R; Tolerance: 10%; Package: 1210; Value: 10uF; Rating: 50V; ComponentLink1Description: digikey; ComponentLink1URL: https://www.digikey.ca/en/products/detail/kemet/C1210C106M5RACTU/4918883
C5 = CAP 8.2nF 50V: CAP CER 8200PF 50V X7R 0805; Tolerance: 10%; Package: 0805; Value: 8.2nF; Rating: 50V; Temperature Coefficient: X7R; Operating Temperature: -55°C ~ 125°C
C6 = CAP 10pF 50V: CAP CER 10PF 50V X7R 0603; Tolerance: 10%; Package: 0603; Value: 10pF; Rating: 50V; ComponentLink1Description: digikey; ComponentLink1URL: https://www.digikey.ca/en/products/detail/kemet/C0603C100K5RAC7867/8572397
C7 = CAP 2700pF 50V: CAP CER 2700PF 50V X7R 0805; Tolerance: 10%; Package: 0805; Value: 2700pF; Rating: 50V; Temperature Coefficient: X7R; Operating Temperature: -55°C ~ 125°C
C8 C14 = CAP 100nF 50V: CAP CER 0.1UF 50V X7R 0805; Tolerance: 10%; Package: 0805; Value: 100nF; Rating: 50V
C12 C13 = CAP 10uF 25V: CAP CER 10UF 25V X5R 1206; Tolerance: 10%; Package: 1206; Value: 10uF; Rating: 25V; Temperature Coefficient: X5R; Operating Temperature: -55°C ~ 85°C
C15 C16 = CAP 22uF 10V: CAP CER 2.2UF 10V X5R 0805; Tolerance: 20%; Package: 0805; Value: 22uF; Rating: 10V; Temperature Coefficient: X5R; Operating Temperature: -55°C ~ 85°C
C17 C18 = CAP 4.7uF 0805: CAP CER 4.7UF 25V X5R 0805; MP: CL21B475KOFNNNE; MF: Samsung Electro-Mechanics; Tolerance: 10%; Rating: 16V; Temperature Coefficient: X7R; Package: 0805; Price: 0,49 CAD; Value: 4.7uF; Digikey: 1276-2873-1-ND; Digikey Link: https://www.digikey.ca/product-detail/en/samsung-electro-mechanics/CL21B475KOFNNNE/1276-2873-1-ND/3890959
D2 = DIODE SCHOTTKY 40V 3A: Diode Schottky 40V 3A Surface Mount SMA; Voltage - Forward (Vf) (Max) @ If: 450mV @ 3A; ComponentLink1Description: digikey; ComponentLink1URL: https://www.digikey.ca/product-detail/en/on-semiconductor/MBR0540T1G/MBR0540T1GOSCT-ND/917967; Voltage - DC Reverse (Vr) (Max): 40V; Package: DO-214AC; Current - Average Rectified (Io): 3A
D3-D6 = LED GREEN SMD: Typical RED, GREEN, YELLOW, AMBER GaAs LED; Voltage - Forward (Vf) (Typ): 2V; Lens Transparency: Clear; Current - Test: 20mA; Package: 1206; Color: Green
L1 = SDR1307-150ML: 15µH Unshielded Wirewound Inductor 4.5A 34mOhm Max Nonstandard; MF: Bourns Inc.; Inductance: 15.0uH; Current - Saturation: 7.5A; MP: SDR1307-150ML; Height - Seated (Max): 0.287"" (7.30mm); ComponentLink1Description: digikey; ComponentLink1URL: https://www.digikey.ca/en/products/detail/bourns-inc/SRU1048-8R2Y/2352912; Digikey: SDR1307-150MLCT-ND; Digikey Link: https://www.digikey.ca/en/products/detail/bourns-inc/SDR1307-150ML/2561929; DC Resistance (DCR): 34mOhm; Operating Temperature: -40°C ~ 125°C; Size / Dimension: 0.512"" L x 0.512"" W (13.00mm x 13.00mm)
L2 = SRN8040-3R3Y: 3.3µH Semi-Shielded Wirewound Inductor 5.6A 21mOhm Max Nonstandard; MF: Bourns Inc.; MP: SRN8040-3R3Y; Price: None; Package: Nonstandard; Inductance: 3.3uH; ComponentLink1Description: digikey; ComponentLink1URL: https://www.digikey.ca/en/products/detail/bourns-inc/SRU1048-8R2Y/2352912; Digikey: SRN8040-3R3YCT-ND; Digikey Link: https://www.digikey.ca/en/products/detail/bourns-inc/SRN8040-3R3Y/2756131
R10 = RES 1.96k 1/8W: RES SMD 1.96K OHM 1% 1/8W 0805; Power (Watts): 0.125W; Package: 0805; Value: 1.96k; Tolerance: 1%
R11 = RES 1k 1/8W: RES SMD 1K OHM 5% 1/8W 0805; Power (Watts): 0.125W; Package: 0805; Value: 1k; Tolerance: 5%
R12 = RES 270 1/8W: RES SMD 270 OHM 5% 1/8W 0805; Power (Watts): 0.125W; Package: 0805; Value: 270; Tolerance: 5%
R13 = RES 110 1/8W: RES SMD 110 OHM 1% 1/8W 0805; Power (Watts): 0.125W; Package: 0805; Value: 110; Tolerance: 1%
R14 = RES 169k 1/8W: RES SMD 169K OHM 1% 1/8W 0805; Power (Watts): 0.125W; Package: 0805; Value: 169k; Tolerance: 1%; ComponentLink1Description: digikey; ComponentLink1URL: https://www.digikey.ca/en/products/detail/yageo/RC0805FR-07169KL/727634
R15 = RES 18.7K OHM 1/8W: RES SMD 18.7K OHM 1% 1/8W; Power (Watts): 0.125W; Value: 18.7k; Tolerance: 1%; Package: 0805; Alternative Package: 1206
R16 R20 = RES 10k 1/8W: as R33 on sheet flyback; Package: 0805; Value: 10k; Tolerance: 1%
R17 = RES 10.2k 1/8W: RES SMD 10.2K OHM 1% 1/8W 0805; Power (Watts): 0.125W; Package: 0805; Value: 10.2k; Tolerance: 1%; ComponentLink1Description: digikey; ComponentLink1URL: https://www.digikey.ca/en/products/detail/panasonic-electronic-components/ERJ-6ENF1022V/111476
R18 = RES 732 1/8W: RES SMD 732 OHM 1% 1/8W 0805; Power (Watts): 0.125W; Package: 0805; Value: 732; Tolerance: 1%
R19 = RES 56.2k 1/10W: RES SMD 56.2K OHM 1% 1/10W 0603; Power (Watts): 0.1W; Package: 0603; Value: 56.2k; Tolerance: 1%
U4 = TPS54531DDA: Buck Switching Regulator IC Positive Adjustable 0.8V 1 Output 5A 8-PowerSOIC _0.154, 3.90mm Width_; MF: Texas Instruments; Value: *; Price: None; Package: SO-8 Texas Instruments; SnapEDA_Link: https://www.snapeda.com/parts/TPS54531DDA/Texas%20Instruments/view-part/289535/?ref=snap; Availability: Unavailable; MP: TPS54531DDA
U5 = TPS563200DDCR: Buck Switching Regulator IC Positive Adjustable 0.76V 1 Output 3A SOT-23-6 Thin, TSOT-23-6; MF: Texas Instruments; Package: TSOT-23 Texas Instruments; Value: *; Price: None; MP: TPS563200DDCR; SnapEDA_Link: https://www.snapeda.com/parts/TPS563200DDCR/Texas%20Instruments/view-part/71685/?ref=snap; Availability: Unavailable
U6 = ZLDO1117K33TC: Linear Voltage Regulator IC Positive Fixed 1 Output  1A TO-252-3; MF: Diodes Incorporated; Package: TO-252-3; MP: ZLDO1117K33TC; Digikey: ZLDO1117K33DIDKR-ND; Digikey Link: https://www.digikey.ca/product-detail/en/diodes-incorporated/ZLDO1117K33TC/ZLDO1117K33DIDKR-ND/2095639

## Sheet chicker.SchDoc
size A4

## Sheet power-input.SchDoc
size A4
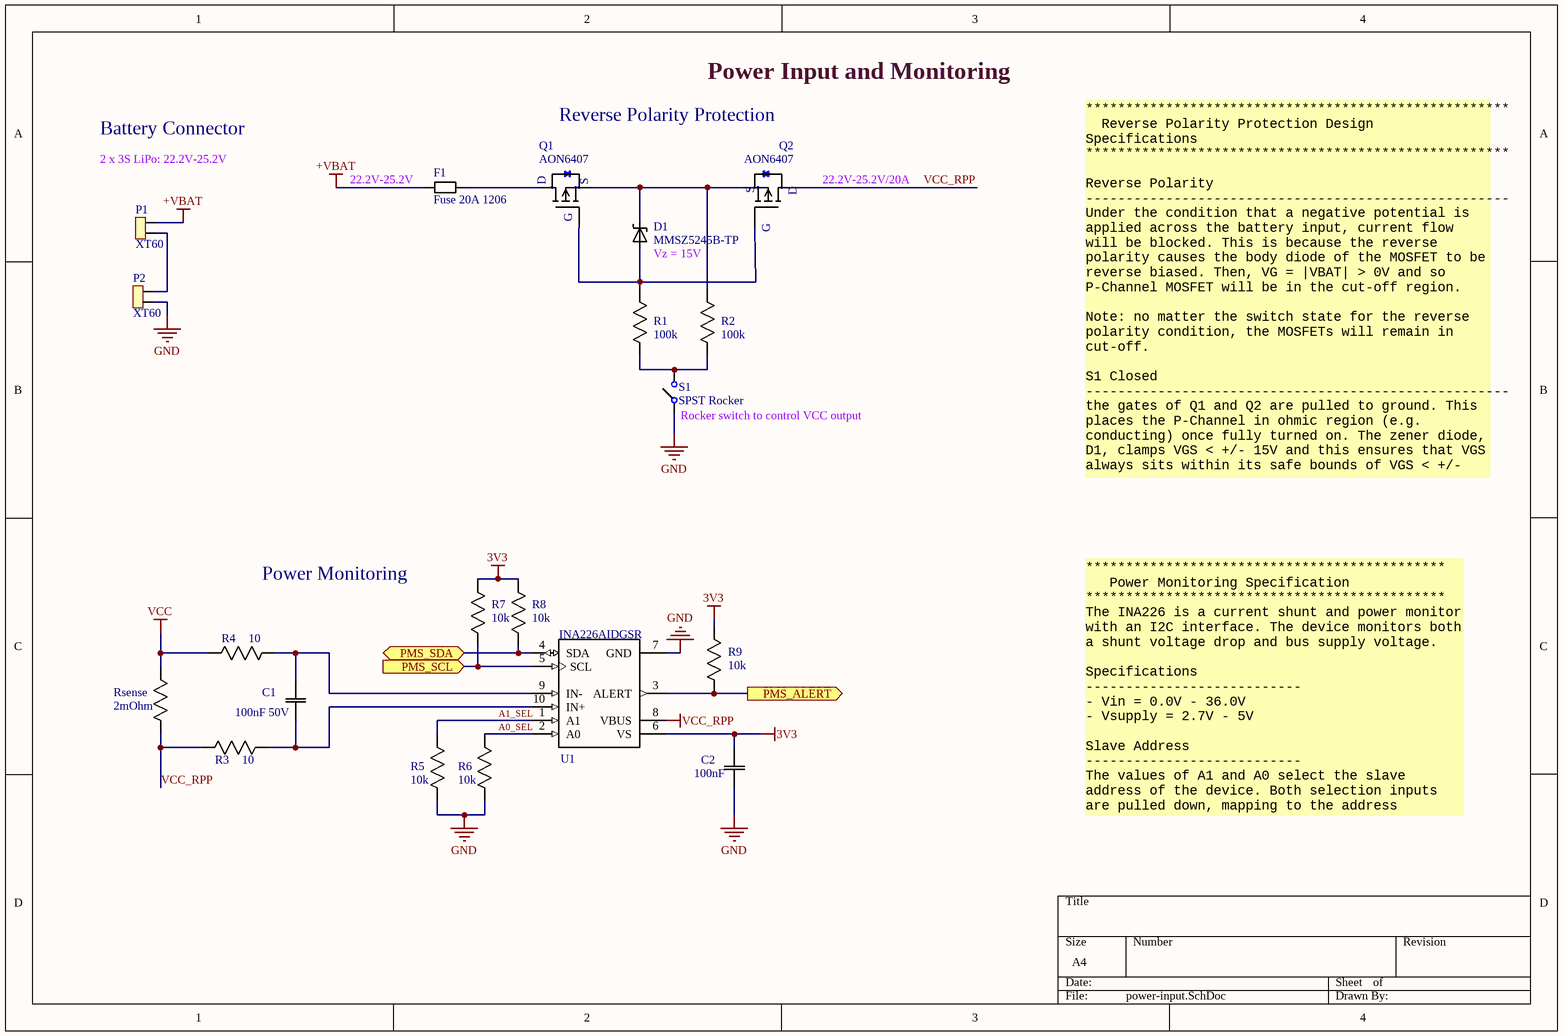
[diagram p3: power-input.SchDoc]

### Parts
C1  100nF 50V  [0805]
C2  100nF  [0805]
D1  MMSZ5245B-TP  [SOD-123]
F1  Fuse 20A 1206  [1206]
P1  XT60  [XT60Connector]
P2  XT60  [XT60Connector]
Q1  AON6407  [8-PowerSMD]
Q2  AON6407  [8-PowerSMD]
R1  100k  [0805]
R2  100k  [0805]
R3  10  [0805]
R4  10  [0805]
R5  10k  [0805]
R6  10k  [0805]
R7  10k  [0805]
R8  10k  [0805]
R9  10k  [0805]
Rsense  2mOhm  [1206]
S1  SPST Rocker  [SWITCH ROCKER SPST 10A 125V]
U1  INA226AIDGSR  [10-VSSOP]

### Ports
PMS_ALERT (out), PMS_SCL (in), PMS_SDA (bidir)

### Nets
3V3: C2.2(C2) R7.1(R1) R8.1(R1) R9.1(R1) U1.6(VS)
+VBAT: F1.1 P1.2
GND: C2.1(C1) P2.1 R5.2(R2) R6.2(R2) S1.0 U1.7(GND)
VCC: R4.2(R2) Rsense.1(R1)
VCC_RPP: Q2.D R3.2(R2) Rsense.2(R2) U1.8(VBUS)
A0_SEL: R6.1(R1) U1.2(A0)
A1_SEL: R5.1(R1) U1.1(A1)
NetC1_1: C1.1(C1) R3.1(R1) U1.10(IN+)
NetC1_2: C1.2(C2) R4.1(R1) U1.9(IN-)
NetD1_A: D1.A Q1.G Q2.G R1.1(R1)
NetD1_C: D1.C Q1.S Q2.S R2.1(R1)
NetF1_2: F1.2 Q1.D
NetP1_1: P1.1 P2.2
NetR1_2: R1.2(R2) R2.2(R2) S1.1
NetR7_2: R7.2(R2) U1.5(SCL) ; port PMS_SCL
NetR8_2: R8.2(R2) U1.4(SDA) ; port PMS_SDA
NetR9_2: R9.2(R2) U1.3(ALERT) ; port PMS_ALERT

### Notes on the sheet
- Power Input and Monitoring
- Battery Connector
- 2 x 3S LiPo: 22.2V-25.2V
- Reverse Polarity Protection
- (near F1) 22.2V-25.2V
- (near Q2) 22.2V-25.2V/20A
- (near D1) Vz = 15V
- (near S1) Rocker switch to control VCC output
- *****************************************************
  Reverse Polarity Protection Design Specifications
  *****************************************************
  Reverse Polarity
  -----------------------------------------------------
  Under the condition that a negative potential is applied across the battery input, current flow will be blocked. This is because the reverse polarity causes the body diode of the MOSFET to be reverse biased. Then, VG = |VBAT| > 0V and so P-Channel MOSFET will be in the cut-off region.
  Note: no matter the switch state for the reverse polarity condition, the MOSFETs will remain in cut-off.
  S1 Closed
  -----------------------------------------------------
  the gates of Q1 and Q2 are pulled to ground. This places the P-Channel in ohmic region (e.g. conducting) once fully turned on. The zener diode, D1, clamps VGS < +/- 15V and this ensures that VGS always sits within its safe bounds of VGS < +/- 25V.
- Power Monitoring
- *********************************************
  Power Monitoring Specification
  *********************************************
  The INA226 is a current shunt and power monitor
  with an I2C interface. The device monitors both a shunt voltage drop and bus supply voltage.
  Specifications
  ---------------------------
  - Vin = 0.0V - 36.0V
  - Vsupply = 2.7V - 5V
  Slave Address
  ---------------------------
  The values of A1 and A0 select the slave address of the device. Both selection inputs are pulled down, mapping to the address 1000000.

### Library data of the parts
C1 C2 = CAP 100nF 0805: CAP CER 0.1UF 50V X7R 0805; MP: CC0805KRX7R9BB104; MF: Yageo; Tolerance: 10%; Package: 0805; Price: 0,119 CAD; Value: 100nF; Digikey: 311-1140-1-ND; Digikey Link: https://www.digikey.ca/products/en?keywords=311-1140-1-ND; Rating: 50V
D1 = MMSZ5245B-TP: Zener Diode 15V 500mW ±5% Surface Mount SOD-123; MP: MMSZ5224BT1G; MF: ON Semiconductor; Price: None; SnapEDA_Link: https://www.snapeda.com/parts/MMSZ5224BT1G/ON%20Semiconductor/view-part/230941/?ref=snap; Package: SOD-123 ON Semiconductor; Availability: Unavailable; Value: *; ComponentLink1Description: digikey; ComponentLink1URL: https://www.digikey.ca/en/products/detail/micro-commercial-co/MMSZ5245B-TP/1793206
F1 = Fuse 20A 1206: FUSE BOARD MOUNT 20A 32VAC 63VDC; MF: Schurter Inc.; MP: 3413.0331.22; Digikey: 486-1689-6-ND; Rating: 20A; Digikey Link: https://www.digikey.ca/product-detail/en/schurter-inc/3413.0331.22/486-1689-6-ND/2870024
P1 P2 = XT60 Connector: XT60 CONNECTORS FEMALE PAIR; MF: SparkFun Electronics; MP: PRT-10474; Digikey: 1568-1816-ND; Digikey Link: https://www.digikey.ca/product-detail/en/sparkfun-electronics/PRT-10474/1568-1816-ND/8258064; Package: XT60; Price: 2.13000 CAD; Value: N/A
Q1 Q2 = AON6407: P-Channel 30V 32A (Ta), 85A (Tc) 7.3W (Ta), 83W (Tc) Surface Mount 8-DFN (5x6); MF: Alpha & Omega Semiconductor Inc.; Package: 8-PowerSMD; MP: AON6407; Digikey: 785-1421-1-ND; Digikey Link: https://www.digikey.ca/product-detail/en/alpha-omega-semiconductor-inc/AON6407/785-1421-1-ND/3466800
R1 R2 = RES 100k 0805: as R26 on sheet flyback; Digikey: 311-100KCRCT-ND; Price: 0.058 CAD; Package: 0805; Value: 100k; Digikey Link: https://www.digikey.ca/products/en?keywords=311-100KCRCT-ND; Tolerance: 1%
R3 R4 = RES 10 0805: RES SMD 10 OHM 1% 1/8W 0805; MP: RC0805FR-0710RL; MF: Yageo; Rating: 0.125W; Digikey: 311-10.0CRCT-ND; Price: 0.15 CAD; Package: 0805; Value: 10; Digikey Link: https://www.digikey.ca/product-detail/en/yageo/RC0805FR-0710RL/311-10.0CRCT-ND/730481; Tolerance: 1%
R5 R6 = RES 10k 1/8W: as R33 on sheet flyback; Package: 0805; Value: 10k; Tolerance: 1%
R7-R9 = RES 10k 0805: RES SMD 10K OHM 1% 1/8W 0805; MP: RC0805FR-0710KL; MF: Yageo; Rating: 0.125W; Digikey: 311-10.0KCRCT-ND; Price: 0.061 CAD; Package: 0805; Value: 10k; Digikey Link: https://www.digikey.ca/products/en?keywords=311-10.0KCRCT-ND; Tolerance: 1%
Rsense = RES 2mOhm 1206: RES 0.002 OHM 1% 1W 1206; MP: CSR1206-0R002F1; MF: Riedon; Value: 0.002; Rating: 0.125W; Digikey: 696-1370-1-ND; Price: 0.88 CAD; Package: 1206; Digikey Link: https://www.digikey.ca/product-detail/en/riedon/CSR1206-0R002F1/696-1370-1-ND/2813303
S1 = SWITCH ROCKER SPST 10A 125V: Rocker Switch SPST 10A (AC) 125V Panel Mount, Snap-In; MP: SRB22A2FBBNN; MF: ZF Electronics; Digikey: CH755-ND; Digikey Link: https://www.digikey.ca/product-detail/en/zf-electronics/SRB22A2FBBNN/CH755-ND/446021; Price: 1.276 CAD; Rating: 10A 125V
U1 = INA226AIDGSR: 36-V, Bi-Directional, Ultra-High Accuracy, Low-/High-Side, I2C Out Current/Power Monitor w/ Alert 10-VSSOP -40 to 125; MF: Texas Instruments; Price: None; MP: INA226AIDGSR; SnapEDA_Link: https://www.snapeda.com/parts/INA226AIDGSR/Texas%20Instruments/view-part/53552/?ref=snap; Package: MSOP-10 Texas Instruments; Availability: Unavailable; Value: *; Digikey: 296-29034-2-ND; Digikey Link: https://www.digikey.ca/product-detail/en/texas-instruments/INA226AIDGSR/296-29034-2-ND/2687236

## Sheet communication.SchDoc
size A4
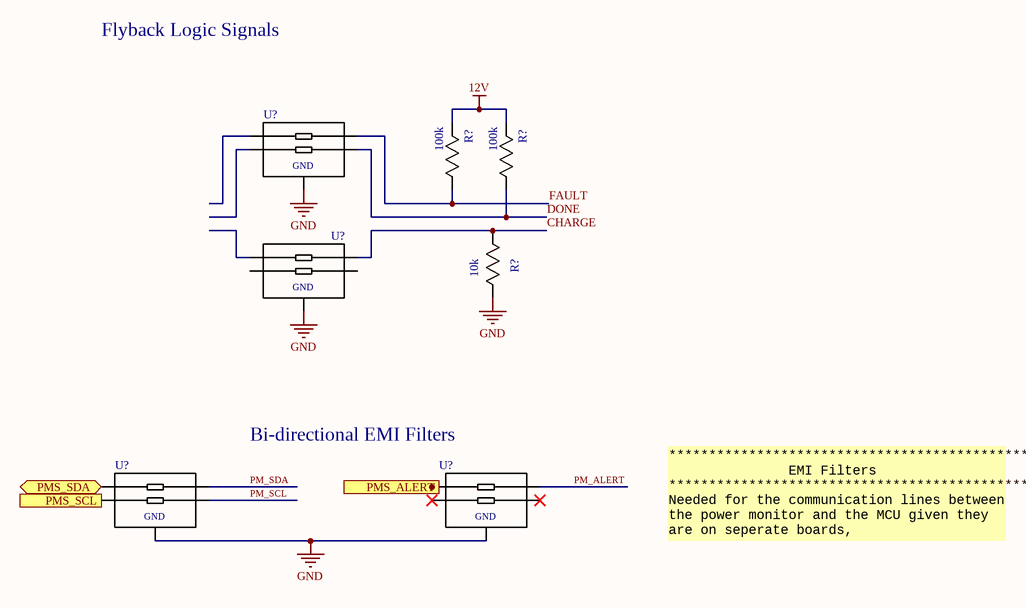
[diagram p4: communication.SchDoc]

### Parts
(Parts that share a designator on the sheet are numbered #1, #2 ... from top to bottom, then left to right.)
R?#1  100k  [0805]
R?#2  100k  [0805]
R?#3  10k  [0805]
U?#1  EMI  [SOT-665]  (value not drawn)
U?#2  EMI  [SOT-665]  (value not drawn)
U?#3  EMI  [SOT-665]  (value not drawn)
U?#4  EMI  [SOT-665]  (value not drawn)

### Ports
PMS_ALERT (in), PMS_SCL (out), PMS_SDA (bidir)

### Nets
12V: R?#1.2(R2) R?#2.2(R2)
GND: R?#3.1(R1) U?#1.2(P$2) U?#2.2(P$2) U?#3.2(P$2) U?#4.2(P$2)
CHARGE: R?#3.2(R2) U?#2.5(P$5)
DONE: R?#2.1(R1) U?#1.4(P$4)
FAULT: R?#1.1(R1) U?#1.5(P$5)
PM_ALERT: U?#4.5(P$5)
PM_SCL: U?#3.4(P$4)
PM_SDA: U?#3.5(P$5)
NetU?#3_1: U?#3.1(P$1) ; port PMS_SDA
NetU?#3_3: U?#3.3(P$3) ; port PMS_SCL

Not connected (* = marked no-connect by the designer): U?#1 1(P$1) 3(P$3); U?#2 1(P$1) 3(P$3) 4(P$4); U?#4 1(P$1) 3(P$3)* 4(P$4)*

### Notes on the sheet
- Flyback Logic Signals
- (near U?#4) Bi-directional EMI Filters
- *********************************************
  EMI Filters
  *********************************************
  Needed for the communication lines between the power monitor and the MCU given they are on seperate boards,
- (in symbol EMI FILTER IP4256CZ5-W) GND
- (in symbol IP4256CZ5-W) GND

### Library data of the parts
R?#1 R?#2 = RES 100k 0805: as R26 on sheet flyback; Digikey: 311-100KCRCT-ND; Price: 0.058 CAD; Package: 0805; Value: 100k; Digikey Link: https://www.digikey.ca/products/en?keywords=311-100KCRCT-ND; Tolerance: 1%
R?#3 = RES 10k 1/8W: as R33 on sheet flyback; Package: 0805; Value: 10k; Tolerance: 1%
U?#1 U?#2 = EMI FILTER IP4256CZ5-W: FILTER RC(PI) 100 OHM/19PF SMD; MF: Nexperia USA Inc.; MP: IP4256CZ5-W,115; SnapEDA_Link: https://www.snapeda.com/parts/IP4256CZ5-W/Nexperia%20USA%20Inc./view-part/3605439/?ref=snap; Price: 0.17 CAD; Package: SOT-665; Digikey: 1727-4718-1-ND; Digikey Link: https://www.digikey.ca/product-detail/en/nexperia-usa-inc/IP4256CZ5-W115/1727-4718-1-ND/2531158
U?#3 U?#4 = IP4256CZ5-W: RC (Pi) EMI Filter 2nd Order Low Pass 2 Channel R = 100Ohms, C = 19pF (Total)  SOT-665; MF: Nexperia USA Inc.; MP: IP4256CZ5-W,115; SnapEDA_Link: https://www.snapeda.com/parts/IP4256CZ5-W/Nexperia%20USA%20Inc./view-part/3605439/?ref=snap; Price: 0.17 CAD; Package: SOT-665; Digikey: 1727-4718-1-ND; Digikey Link: https://www.digikey.ca/product-detail/en/nexperia-usa-inc/IP4256CZ5-W115/1727-4718-1-ND/2531158

## Nets that join several sheets
3V3: regulation (C18.2 R13.1 U6.2), power-input (5 pins)
12V: flyback (7 pins), regulation (10 pins), communication (R?#1.2 R?#2.2)
GND: flyback (13 pins), regulation (28 pins), power-input (6 pins), communication (5 pins)
VCC: flyback (7 pins), regulation (5 pins), power-input (R4.2 Rsense.1)